# EAGLE design cell-supervisor (EAGLE 5.02)
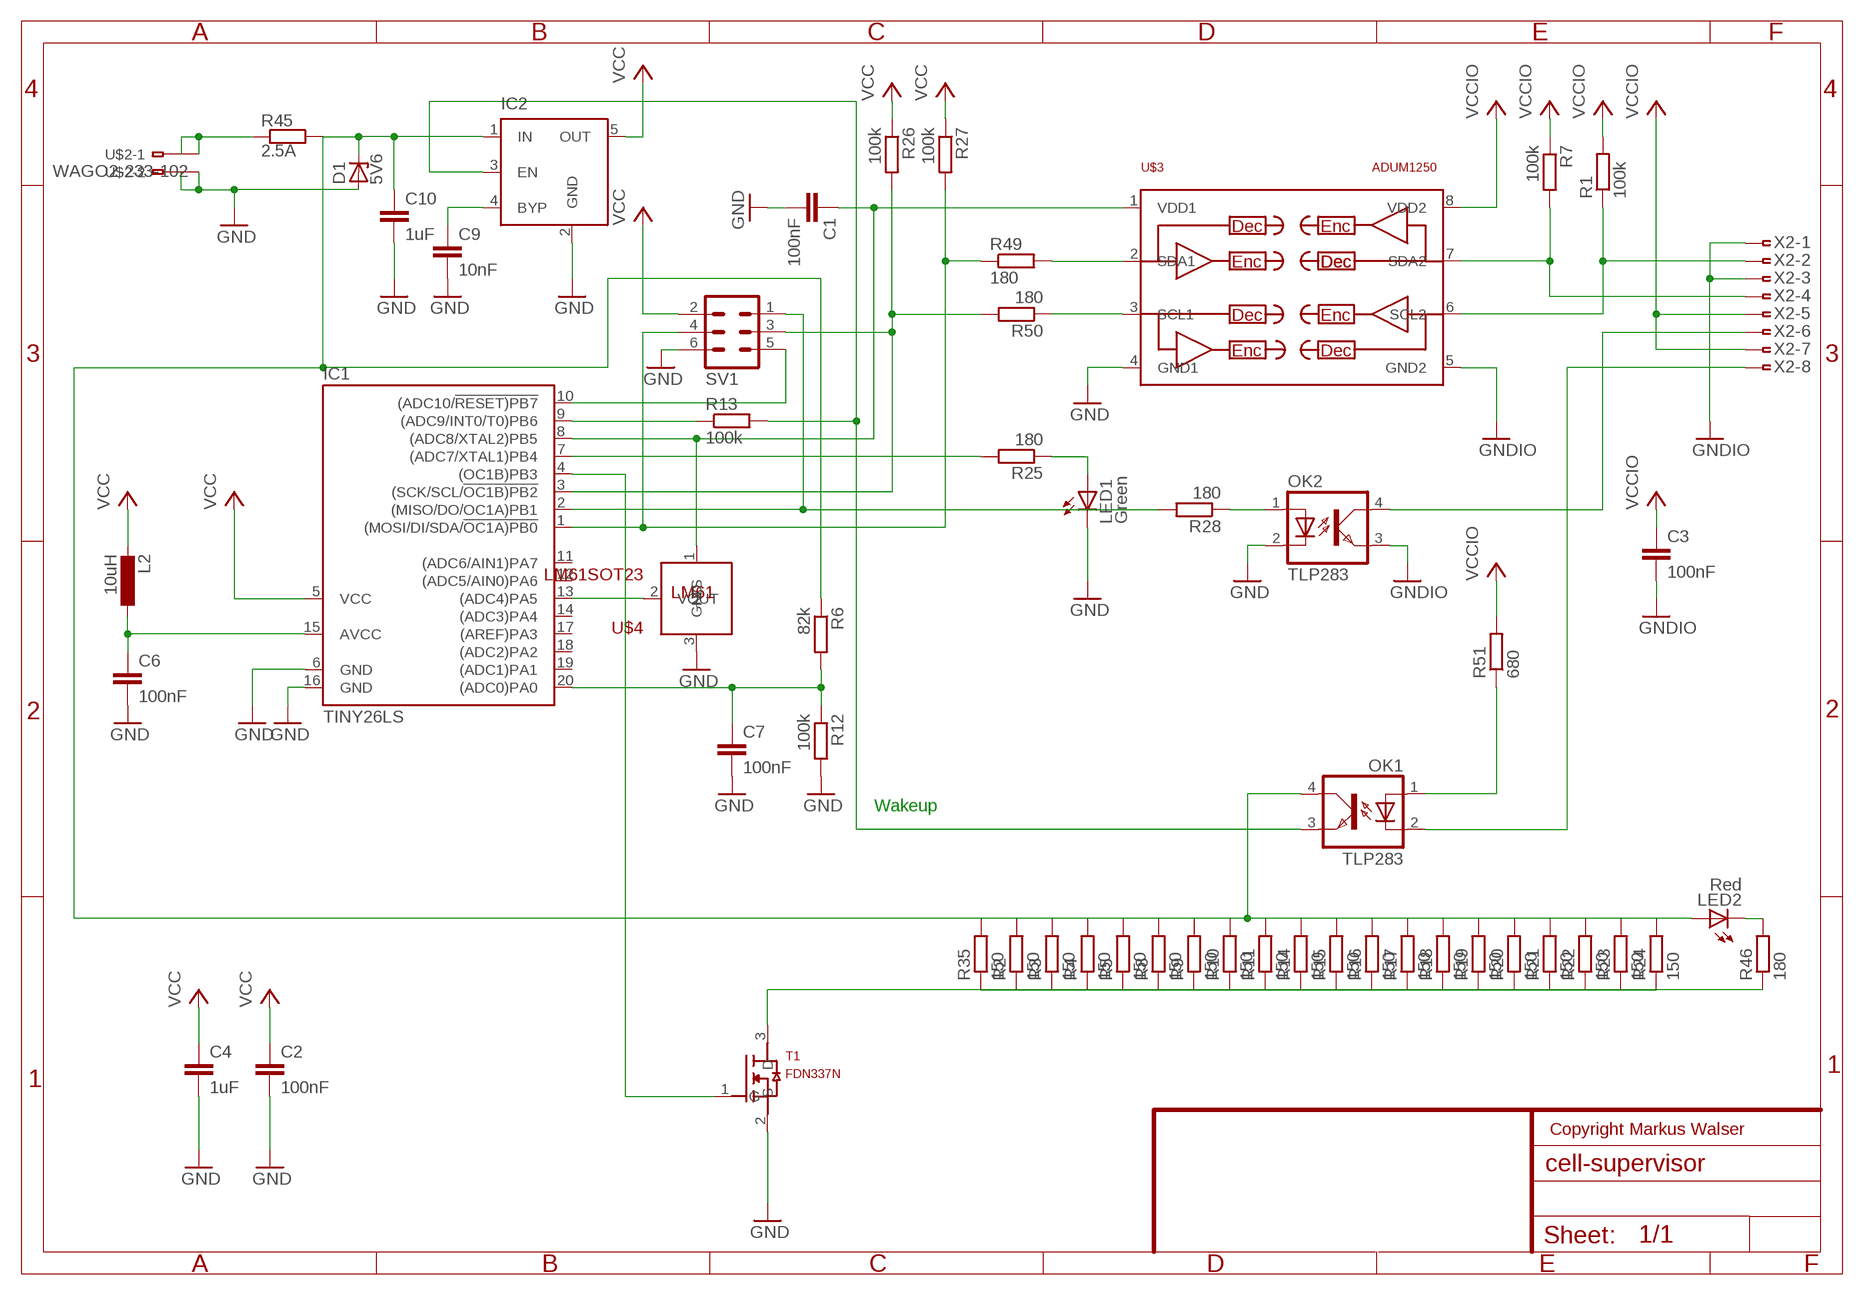
[diagram p0: schematic, sheet 1]

## Parts
C1  100nF  C-EUC0504  [C0504]
C2  100nF  C-EUC0504  [C0504]
C3  100nF  C-EUC0504  [C0504]
C4  1uF  C-EUC0603K  [C0603K]
C6  100nF  C-EUC0504  [C0504]
C7  100nF  C-EUC0504  [C0504]
C9  10nF  C-EUC0504  [C0504]
C10  1uF  C-EUC0603K  [C0603K]
D1  5V6  ZENER-DIODESMB  [SMB]
IC1  TINY26LS  [SO20L]
IC2  MIC5219XX  [SOT23-5]
L2  10uH  L-EUL3225M  [L3225M]
LED1  Green  LEDCHIPLED_0805  [CHIPLED_0805]
LED2  Red  LEDCHIPLED_0805  [CHIPLED_0805]
OK1  TLP283  [MINI-FLAT-4]
OK2  TLP283  [MINI-FLAT-4]
R1  100k  R-EU_M0805  [M0805]
R2  150  R-EU_R1206  [R1206]
R3  150  R-EU_R1206  [R1206]
R4  150  R-EU_R1206  [R1206]
R5  150  R-EU_R1206  [R1206]
R6  82k  R-EU_M0805  [M0805]
R7  100k  R-EU_M0805  [M0805]
R8  150  R-EU_R1206  [R1206]
R9  150  R-EU_R1206  [R1206]
R10  150  R-EU_R1206  [R1206]
R11  150  R-EU_R1206  [R1206]
R12  100k  R-EU_M0805  [M0805]
R13  100k  R-EU_M0805  [M0805]
R14  150  R-EU_R1206  [R1206]
R15  150  R-EU_R1206  [R1206]
R16  150  R-EU_R1206  [R1206]
R17  150  R-EU_R1206  [R1206]
R18  150  R-EU_R1206  [R1206]
R19  150  R-EU_R1206  [R1206]
R20  150  R-EU_R1206  [R1206]
R21  150  R-EU_R1206  [R1206]
R22  150  R-EU_R1206  [R1206]
R23  150  R-EU_R1206  [R1206]
R24  150  R-EU_R1206  [R1206]
R25  180  R-EU_M0805  [M0805]
R26  100k  R-EU_M0805  [M0805]
R27  100k  R-EU_M0805  [M0805]
R28  180  R-EU_M0805  [M0805]
R35  150  R-EU_R1206  [R1206]
R45  2.5A  SMR-WAV  [SMS-WAV]
R46  180  R-EU_M0805  [M0805]
R49  180  R-EU_M0805  [M0805]
R50  180  R-EU_M0805  [M0805]
R51  680  R-EU_M0805  [M0805]
SV1  MA03-2  [MA03-2]
T1  FDN337N  [SOT23]
U$2  WAGO2-233-102  [233-102]
U$3  ADUM1250  [SO8]
U$4  LM61SOT23  [SOT23]
X2  FSIDE-8  [FSIDE-8]

## Nets
GND: C1.2 C2.2 C4.2 C6.2 C7.2 C9.2 C10.2 D1.A IC1.6(GND) IC1.16(GND) IC2.2(GND) LED1.C OK2.2(C) R12.2 SV1.6 T1.2(S) U$2.A2(-2:A1) U$2.B2(-2:B1) U$3.4(GND1) U$4.3(GND)
GNDIO: C3.2 OK2.3(EMIT) U$3.5(GND2) X2.1 X2.3
N$1: C1.1 IC1.8((ADC8/XTAL2)PB5) U$3.1(VDD1) U$4.1(+VS)
N$2: R7.2 U$3.7(SDA2) X2.4
N$3: R1.1 U$3.6(SCL2) X2.2
N$4: IC1.7((ADC7/XTAL1)PB4) R25.2
N$5: LED1.A R25.1
N$6: R49.2 U$3.2(SDA1)
N$7: OK1.2(C) X2.8
N$8: R50.1 U$3.3(SCL1)
N$10: IC1.3((SCK/SCL/!OC1B)PB2) R26.2 R50.2 SV1.3
N$11: LED2.C R46.2
N$13: C10.1 D1.C IC2.1(IN) LED2.A OK1.4(COL) R2.2 R3.2 R4.2 R5.2 R6.1 R8.2 R9.2 R10.2 R11.2 R14.2 R15.2 R16.2 R17.2 R18.2 R19.2 R20.2 R21.2 R22.2 R23.2 R24.2 R35.2 R45.1
N$14: C7.1 IC1.20((ADC0)PA0) R6.2 R12.1
N$15: C6.1 IC1.15(AVCC) L2.1
N$18: OK2.1(A) R28.1
N$19: OK2.4(COL) X2.6
N$20: C9.1 IC2.4(BYP)
N$21: IC1.9((ADC9/INT0/T0)PB6) R13.1
N$22: IC1.13((ADC4)PA5) U$4.2(VOUT)
N$49: R2.1 R3.1 R4.1 R5.1 R8.1 R9.1 R10.1 R11.1 R14.1 R15.1 R16.1 R17.1 R18.1 R19.1 R20.1 R21.1 R22.1 R23.1 R24.1 R35.1 R46.1 T1.3(D)
N$50: IC1.4((OC1B)PB3) T1.1(G)
N$51: IC1.2((MISO/DO/OC1A)PB1) R28.2 SV1.1
N$53: IC1.10((ADC10/!RESET)PB7) SV1.5
N$59: R45.2 U$2.A1(-1:A1) U$2.B1(-1:B1)
N$63: IC1.1((MOSI/DI/SDA/!OC1A)PB0) R27.2 R49.1 SV1.4
N$66: OK1.1(A) R51.1
N$68: IC2.3(EN) OK1.3(EMIT) R13.2
VCC: C2.1 C4.1 IC1.5(VCC) IC2.5(OUT) L2.2 R26.1 R27.1 SV1.2
VCCIO: C3.1 R1.2 R7.1 R51.2 U$3.8(VDD2) X2.5 X2.7
Unconnected: IC1.11((ADC6/AIN1)PA7) IC1.12((ADC5/AIN0)PA6) IC1.14((ADC3)PA4) IC1.17((AREF)PA3) IC1.18((ADC2)PA2) IC1.19((ADC1)PA1)

## Notes on the sheet
- Wakeup
- Copyright Markus Walser

## Library data of the parts
C1-C4 C6 C7 C9 C10 = rcl:C-EU: CAPACITOR, European symbol
D1 = diode:ZENER-DIODE: Z-Diode
IC1 = atmel:TINY26*: 8-bit AVR Microcontroller with 2K Bytes Flash Source: http://www.atmel.com .. doc1477.pdf
IC2 = v-reg-micrel:MIC5219XX: VOLTAGE REGULATOR
L2 = rcl:L-EU: INDUCTOR, European symbol
LED1 LED2 = led:LED: LED OSRAM: - CHIPLED LG R971, LG N971, LY N971, LG Q971, LY Q971, LO R971, LY R971 LH N974, LH R974 LS Q976, LO Q976, LY Q976 LO Q996 - Hyper CHIPLED LW Q18S LB Q993, LB Q99A, LB R99A - SideLED LS A670, LO A670, LY A670, LG A670, LP A670 LB A673, LV A673, LT A673, LW A673 LH A674 LY A675 LS A676, LA A676, LO A676, LY A676, LW A676 LS A679, LY A679, LG A679 - Hyper Micro SIDELED® LS Y876, LA Y876, LO Y876, LY Y876 LT Y87S - SmartLED LW L88C, LW L88S LB L89C, LB L89S, LG L890 LS L89K, LO L89K, LY L89K LS L896, LA L896, LO L896, LY L896 - TOPLED LS T670, LO T670, LY T670, LG T670, LP T670 LSG T670, LSP T670, LSY T670, LOP T670, LYG T670 LG T671, LOG T671, LSG T671 LB T673, LV T673, LT T673, LW T673 LH T674 LS T676, LA T676, LO T676, LY T676, LB T676, LH T676, LSB T676, LW T676 LB T67C, LV T67C, LT T67C, LS T67K, LO T67K, LY T67K, LW E67C LS E67B, LA E67B, LO E67B, LY E67B, LB E67C, LV E67C, LT E67C LW T67C LS T679, LY T679, LG T679 LS T770, LO T770, LY T770, LG T770, LP T770 LB T773, LV T773, LT T773, LW T773 LH T774 LS E675, LA E675, LY E675, LS T675 LS T776, LA T776, LO T776, LY T776, LB T776 LHGB T686 LT T68C, LB T68C - Hyper Mini TOPLED® LB M676 - Mini TOPLED Santana® LG M470 LS M47K, LO M47K, LY M47K Source: http://www.osram.convergy.de - LUMILED® LXK2-PW12-R00, LXK2-PW12-S00, LXK2-PW14-U00, LXK2-PW14-V00 LXK2-PM12-R00, LXK2-PM12-S00, LXK2-PM14-U00 LXK2-PE12-Q00, LXK2-PE12-R00, LXK2-PE12-S00, LXK2-PE14-T00, LXK2-PE14-U00 LXK2-PB12-K00, LXK2-PB12-L00, LXK2-PB12-M00, LXK2-PB14-N00, LXK2-PB14-P00, LXK2-PB14-Q00 LXK2-PR12-L00, LXK2-PR12-M00, LXK2-PR14-Q00, LXK2-PR14-R00 LXK2-PD12-Q00, LXK2-PD12-R00, LXK2-PD12-S00 LXK2-PH12-R00, LXK2-PH12-S00 LXK2-PL12-P00, LXK2-PL12-Q00, LXK2-PL12-R00 Source: www.luxeon.com
OK1 OK2 = optocoupler:TLP283: TOSHIBA PHOTOCOUPLER GaAs IRED & PHOTO-TRANSISTOR Source: http://www.semicon.toshiba.co.jp/td/en/Opto/Photocoupler/en_20050928_TLP283_datasheet.pdf
R1-R28 R35 R46 R49-R51 = rcl:R-EU_: RESISTOR, European symbol
R45 = resistor-shunt:SMR-WAV: SMD SHUNT RESISTOR
SV1 = con-lstb:MA03-2: PIN HEADER
T1 = transistor-fet:FDN337N
U$2 = con-wago:WAGO2-: WAGO Cage Clamp
U$3 = analog-devices:ADUM1250
U$4 = linear:LM61
X2 = con-amp:FSIDE-8: AMP connector

## Board
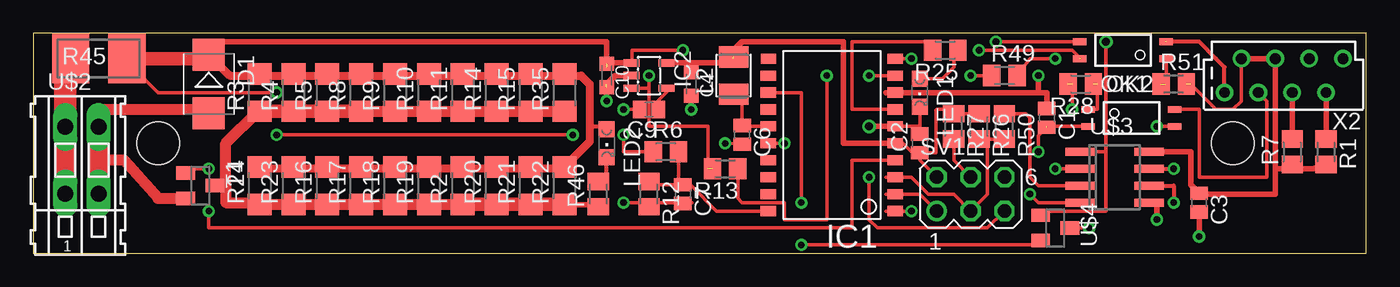
[diagram p1: board, top side]
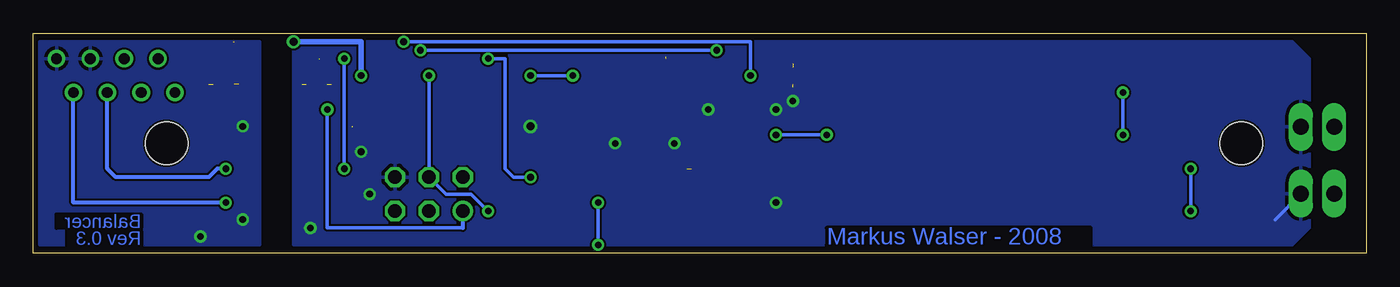
[diagram p2: board, bottom side, seen from below]

Size 100 x 16.5 mm. Coordinates in mm from the lower left corner, seen from the top.
Outline: 0,0 100,0 100,16.5 0,16.5 0,0
Copper layers (1*16): Top 0.035mm / dielectric 1.5mm / Bottom 0.035mm
Design rules "default": minimum track width 10mil, minimum drill 24mil, track to track 6mil, track to pad 6mil, pad to pad 6mil, via to via 6mil, smd to smd 6mil, copper to edge 6mil, drill to drill 6mil, minimum pad ring 10mil, minimum via ring 8mil, stop-mask expansion 4mil, vias tented up to drill 40mil, thermal gap 10mil
Holes 3.2 mm at 9.36,8.25 90,8.25

### Footprints (pad centres in the part's own frame; a part is rotated, then mirrored left to right if it is on the bottom)
C0504 = smd 1 x 1.3: 1 -0.7,0; 2 0.7,0
C0603K = smd 1.05 x 1.08: 1 -0.875,0; 2 0.875,0
SMB = smd 2.4 x 2.4: A 2.2,0; C -2.2,0
SO20L = smd 0.762 x 1.143: 1 -5.08,-5.131; 2 -3.81,-5.131; 3 -2.54,-5.131; 4 -1.27,-5.131; 5 0,-5.131; 6 1.27,-5.131; 7 2.54,-5.131; 8 3.81,-5.131; 9 5.08,-5.131; 10 6.35,-5.131; 11 6.35,4.369; 12 5.08,4.394; 13 3.81,4.394; 14 2.54,4.394; 15 1.27,4.394; 16 0,4.394; 17 -1.27,4.394; 18 -2.54,4.394; 19 -3.81,4.394; 20 -5.08,4.394
SOT23-5 = smd 0.55 x 1.2: 1 -0.95,-1.3; 2 0,-1.3; 3 0.95,-1.3; 4 0.95,1.3; 5 -0.95,1.3
L3225M = smd 1.6 x 2.2: 1 -1.4,0; 2 1.4,0
CHIPLED_0805 = smd 1.2 x 1.2: A 0,-1.05; C 0,1.05
MINI-FLAT-4 = smd 1 x 0.5: 1 -3.24,0.635; 2 -3.24,-0.635; 3 3.24,-0.635; 4 3.24,0.635
M0805 = smd 1.3 x 1.6: 1 -0.95,0; 2 0.95,0
R1206 = smd 1.6 x 1.8: 1 -1.4,0; 2 1.4,0
SMS-WAV = smd 2.8 x 3.7: 1 2.108,0; 2 -2.108,0
MA03-2 = drill 1.016 round: 1 -2.54,-1.27 | drill 1.016 octagon: 2 -2.54,1.27; 3 0,-1.27; 4 0,1.27; 5 2.54,-1.27; 6 2.54,1.27
SOT23 = smd 1 x 1.4: 1 -0.95,-1.1; 2 0.95,-1.1; 3 0,1.1
233-102 = drill 1.2 long: A1 -1.25,2.5; A2 1.25,2.5; B1 -1.25,-2.5; B2 1.25,-2.5
SO8 = smd 0.6 x 2.2: 1 -1.905,-2.6; 2 -0.635,-2.6; 3 0.635,-2.6; 4 1.905,-2.6; 5 1.905,2.6; 6 0.635,2.6; 7 -0.635,2.6; 8 -1.905,2.6
FSIDE-8 = drill 0.813 round: 1 -4.445,-1.27; 2 -3.175,1.27; 3 -1.905,-1.27; 4 -0.635,1.27; 5 0.635,-1.27; 6 1.905,1.27; 7 3.175,-1.27; 8 4.445,1.27

### Placement (x,y rotation side)
C1  76.03,10.16 270 top
C2  66.51,8.25 90 top
C3  87.47,3.81 270 top
C4  49.37,12.7 270 top
C6  53.17,8.89 270 top
C7  48.73,4.44 270 top
C9  46.19,10.79 180 top
C10  43.02,13.33 270 top
D1  13.17,12.7 270 top
IC1  59.52,8.25 90 top
IC2  46.19,13.33 270 top
L2  52.54,13.33 90 top
LED1  66.51,12.06 180 top
LED2  43.02,8.25 180 top
OK1  81.75,15.23 180 top
OK2  82.39,10.16 0 top
R1  96.99,7.62 270 top
R2  32.22,5.08 90 top
R3  16.98,12.06 90 top
R4  19.52,12.06 90 top
R5  22.06,12.06 90 top
R6  47.46,7.62 0 top
R7  94.45,7.62 90 top
R8  24.6,12.06 90 top
R9  27.14,12.06 90 top
R10  29.68,12.06 90 top
R11  32.22,12.06 90 top
R12  46.19,4.44 270 top
R13  51.91,6.34 180 top
R14  34.76,12.06 90 top
R15  37.3,12.06 90 top
R16  22.06,5.08 90 top
R17  24.6,5.08 90 top
R18  27.14,5.08 90 top
R19  29.68,5.08 90 top
R20  34.76,5.08 90 top
R21  37.3,5.08 90 top
R22  39.84,5.08 90 top
R23  19.52,5.08 90 top
R24  16.98,5.08 90 top
R25  68.41,15.23 180 top
R26  70.95,9.52 270 top
R27  69.05,9.52 270 top
R28  78.58,12.7 180 top
R35  39.84,12.06 90 top
R45  4.92,14.6 0 top
R46  42.38,4.44 90 top
R49  72.86,13.33 0 top
R50  72.86,9.52 270 top
R51  85.56,12.7 0 top
SV1  70.32,4.44 0 top
T1  12.54,5.08 270 top
U$2  3.64,6.98 0 top
U$3  81.11,5.71 270 top
U$4  76.67,1.9 270 top
X2  93.81,13.33 180 top

### Tracks (layer width: path | path; a pad name or v marks a point on that pad's centre or on a via)
GND  (via drill 0.5, 0.6)  (2 unrouted)
  Top 0.254: R12.2 46.82,3.81 47.46,3.81 | C7.2 48.8,3.81 48.73,3.81 | 47.46,3.81 47.14,3.81 | 48.73,3.81 47.46,3.81 | 49.37,3.81 48.73,3.81 | C7.2 49.43,3.81 | 53.11,8.25 C6.2 v51.91,8.25 | 66.51,8.89 C2.2 66.51,9.52 | 66.51,9.52 LED1.C | IC1.6 66.51,9.52 | 49.37,3.81 C7.2 | v44.28,3.81 49.37,3.81 | IC1.16 v56.35,8.25 | 76.03,9.52 OK2.2 | U$4.3 v79.21,1.9 | C1.2 75.4,8.82 v75.4,7.62 | U$3.4 75.4,3.81 v74.77,4.44 | C9.2 v44.28,10.79
  Top 0.406: v62.7,9.52 IC1.6 | IC2.2 43.65,13.33 43.02,12.7 v43.02,11.42 | C4.2 v49.37,10.79
  Top 0.813: D1.A 13.17,10.79 4.92,10.79 4.92,10.16 | 4.92,10.16 4.92,10.14 U$2.A2 4.89,10.14 4.92,10.16 | T1.2 9.36,4.12 6.82,6.98 6.79,7.01 4.92,7.01 4.92,4.44 4.89,4.46 U$2.B2
  Top 1.676: U$2.B2 4.89,10.14
  Bottom 0.254: 4.92,3.81 4.94,5.05 4.89,5.09 U$2.B2 4.89,4.46 6.82,2.53
  pour Bottom: 4.28,1.9 4.28,14.6 5.55,15.87 80.48,15.87 80.48,0.63 5.55,0.63
GNDIO  (via drill 0.5)
  Top 0.254: U$3.5 84.29,3.81 | OK2.3 v84.29,9.52
  Top 0.406: U$3.5 83.66,3.81 | 84.29,3.81 v84.29,2.53 | C3.2 v87.47,1.27
  pour Bottom: 83.02,0.63 83.02,15.87 99.53,15.87 99.53,0.63
N$1  (via drill 0.5, 0.6)
  Top 0.254: U$4.1 75.89,2.53 75.4,2.53 75.4,3.17 80.48,3.17 80.48,7.62 | 80.48,7.62 v80.48,15.87 | 80.48,7.62 77.94,7.62
  Top 0.406: 63.97,12.06 IC1.8 75.4,12.06 | v75.4,13.33 75.4,12.06 | 75.4,12.06 76.03,12.06 C1.1 | 77.94,7.62 U$3.1
  Bottom 0.406: v80.48,15.87 75.4,15.87 v75.4,13.33
N$2  (via drill 0.5)
  Top 0.305: U$3.7 v85.56,6.34
  Top 0.406: X2.4 R7.2
  Bottom 0.305: v85.56,6.34 86.19,6.34 86.83,5.71 93.81,5.71 94.45,6.34 X2.4
N$3  (via drill 0.5)
  Top 0.305: U$3.6 85.56,5.08 v85.56,3.81
  Top 0.406: X2.2 R1.1
  Bottom 0.305: v85.56,3.81 96.99,3.81 X2.2
N$4
  Top 0.254: R25.2 67.47,15.87 61.43,15.87 61.43,10.79 IC1.7
N$5
  Top 0.254: LED1.A 68.19,13.11 69.05,13.97 69.05,15.23 R25.1
N$6  (via drill 0.5)
  Top 0.254: v76.67,14.6 74.77,14.6 R49.2 | U$3.2 v76.67,6.34
  Bottom 0.254: v76.67,6.34 v76.67,14.6
N$7  (1 unrouted)
  Top 0.305: X2.8 89.37,13.97 88.73,14.6 87.47,15.87 84.92,15.87
N$8
  Top 0.254: 77.94,5.08 U$3.3 75.4,5.08 74.77,5.71 74.77,10.16 74.45,10.47 R50.1
N$10
  Top 0.254: 63.97,5.71 IC1.3 65.88,5.71 67.14,4.44 69.05,4.44 SV1.3 71.59,4.44 71.59,8.25 70.95,8.89 | R50.2 71.27,8.57 70.95,8.89 | 70.95,8.89 R26.2
N$11
  Top 0.305: R46.2 42.38,5.08 43.02,5.71 LED2.C
N$13  (via drill 0.5)  (2 unrouted)
  Top 0.254: 6.82,14.6 9.36,12.06 v18.25,12.06 | v18.25,8.89 v40.48,8.89 | v70.95,15.23 77.94,15.23 78.58,14.6 | v44.28,8.89 44.28,7.62 R6.1 | IC2.1 44.92,14.28 44.92,15.23 v48.73,15.23
  Top 0.305: LED2.A 42.8,9.52 41.74,9.52
  Top 0.406: D1.C 13.17,15.87 43.02,15.87 C10.1 | 37.3,13.33 R15.2 37.17,13.33 | 39.71,13.33 R35.2 | 34.76,13.33 R14.2 34.63,13.33 | 32.22,13.33 R11.2 32.09,13.33 | 29.68,13.33 R10.2 29.55,13.33 | 27.14,13.33 R9.2 27.01,13.33 | 24.6,13.33 R8.2 24.47,13.33 | 22.06,13.33 R5.2 21.93,13.33 | 19.52,13.33 R4.2 19.39,13.33 | 16.98,13.33 R3.2 | IC2.1 43.33,14.28 43.02,13.97
  Top 0.61: 37.3,13.33 39.71,13.33 | 34.76,13.33 37.17,13.33 | 32.22,13.33 34.63,13.33 | 29.68,13.33 32.09,13.33 | 27.14,13.33 29.55,13.33 | 24.6,13.33 27.01,13.33 | 22.06,13.33 24.47,13.33 | 19.52,13.33 21.93,13.33 | 19.39,13.33 16.98,13.33 14.74,13.33 D1.C | R35.2 39.84,13.33 41.11,13.33 41.74,12.7 41.74,9.52 41.74,8.38 R22.2 39.71,6.34 37.3,6.34 R21.2 37.17,6.34 34.76,6.34 R20.2 34.63,6.34 32.22,6.34 R2.2 32.09,6.34 29.68,6.34 R19.2 29.55,6.34 27.14,6.34 R18.2 27.01,6.34 24.6,6.34 R17.2 24.47,6.34 22.06,6.34 R16.2 21.93,6.34 19.52,6.34 R23.2 19.39,6.34 16.98,6.34 R24.2
  Top 1.016: D1.C 13.17,14.6 6.82,14.6 R45.1
  Bottom 0.254: v18.25,12.06 v18.25,8.89 | v40.48,8.89 v44.28,8.89 | v48.73,15.23 v70.95,15.23
N$14
  Top 0.254: IC1.20 51.27,3.17 49.37,5.08 48.73,5.08 | R12.1 46.82,5.08 46.89,5.14 C7.1 48.73,5.08 | R6.2 48.41,5.4 48.73,5.08
N$15
  Top 0.254: 53.17,9.52 IC1.15 | C6.1 53.17,9.52 | L2.1 53.05,12.06 53.17,12.06 53.17,9.52
N$18  (1 unrouted)
  Top 0.254: OK2.1 79.84,10.79 79.84,12.7
N$19
  Top 0.254: X2.6 92.55,11.42 92.55,5.71 87.47,5.71 87.47,10.79 OK2.4
N$20
  Top 0.254: C9.1 46.89,11.49 47.49,12.09 IC2.4
N$21  (via drill 0.5)
  Top 0.254: v62.7,13.33 IC1.9 | R13.1 52.85,4.12 53.17,3.81 56.35,3.81 56.35,2.53 59.52,2.53 v59.52,13.33
  Bottom 0.254: v59.52,13.33 v62.7,13.33
N$22  (via drill 0.5)
  Top 0.254: v57.62,3.81 57.62,12.06 IC1.13 | U$4.2 75.89,0.63 v57.62,0.63
  Bottom 0.254: v57.62,0.63 v57.62,3.81
N$49
  Top 0.406: R46.1 42.38,3.81 41.57,3.64 40.01,3.64
  Top 0.61: T1.3 14.44,5.08
  Top 0.813: 24.6,10.79 24.73,10.66 R9.1 27.14,10.79 27.27,10.66 R10.1 29.68,10.79 29.81,10.66 R11.1 32.22,10.79 32.35,10.66 R14.1 34.76,10.79 34.89,10.66 R15.1 37.3,10.79 37.43,10.66 R35.1 | R2.1 29.81,3.67 29.68,3.81 R19.1 27.27,3.67 27.14,3.81 R18.1 24.73,3.67 24.6,3.81 R17.1 22.19,3.67 22.06,3.81 R16.1 19.65,3.67 19.52,3.81 R23.1 17.11,3.67 16.98,3.81 | 39.84,3.81 40.01,3.64 | 16.98,3.81 R24.1 | 16.98,3.81 14.44,3.81 14.44,5.08 14.44,8.25 16.85,10.66 R3.1
  Top 1.016: R3.1 19.39,10.66 19.52,10.79 R4.1 21.93,10.66 22.06,10.79 R5.1 24.47,10.66 24.6,10.79 R8.1 | R22.1 39.84,3.81 39.71,3.67 R21.1 34.89,3.67 34.76,3.81 R20.1 32.35,3.67 32.22,3.81 R2.1
N$50  (via drill 0.5)
  Top 0.254: IC1.4 61.43,6.98 61.43,1.9 13.17,1.9 v13.17,3.17 | 11.27,6.03 11.27,5.71 | 11.27,6.03 T1.1 | v13.17,6.34 11.27,6.34 11.27,6.03
  Bottom 0.254: v13.17,3.17 v13.17,6.34
N$51  (via drill 0.5)  (1 unrouted)
  Top 0.254: SV1.1 66.51,4.44 IC1.2 63.97,4.44 | v77.94,10.79 77.94,12.7
  Bottom 0.254: 67.78,1.9 77.94,1.9 v77.94,10.79
  Bottom 0.305: SV1.1 67.78,1.9
N$53  (via drill 0.5, 0.5 pad 0.25)
  Top 0.254: SV1.5 71.59,1.9 63.34,1.9 62.7,2.53 v62.7,5.71 | v65.88,14.6 IC1.10
  Bottom 0.254: v62.7,5.71 63.97,5.71 64.61,6.34 64.61,14.6 v65.88,14.6
N$59
  Top 0.813: R45.2 2.58,14.4 2.38,14.6 3.01,14.6 2.38,13.97 2.38,12.7 2.4,12.67 | U$2.A1 2.4,10.14 2.38,10.16
  Top 1.676: U$2.A1 2.4,12.67 | U$2.B1 2.4,10.14
N$63  (via drill 0.5, 0.5 pad 0.3)
  Top 0.254: v70.32,13.33 R49.1 | 63.97,3.17 IC1.1 v65.88,3.17 | R27.2 69.05,6.98 SV1.4
  Bottom 0.254: v70.32,13.33 SV1.4 69.05,4.44 67.14,4.44 v65.88,3.17
N$66  (1 unrouted)
  Top 0.254: 84.99,12.76 OK1.1
  Top 0.305: 84.92,12.7 84.99,12.76
N$68  (via drill 0.5)  (1 unrouted)
  Top 0.254: v72.22,15.87 OK1.3 78.58,15.87 | 46.19,12.7 46.19,9.52 50.63,9.52 50.63,6.34 51.27,6.34 | 46.19,12.7 v46.19,13.33 | IC2.3 46.19,12.38 46.19,12.7
  Bottom 0.254: v72.22,15.87 50.63,15.87 46.19,15.87 v46.19,13.33
VCC  (1 unrouted)
  Top 0.254: IC1.5 65.24,8.25 65.88,7.62 66.51,7.62 | SV1.2 66.51,6.98 66.51,7.62 | 66.51,7.62 C2.1 67.72,7.55 67.72,10.73 67.78,10.79 69.05,10.79 R27.1 69.05,10.16 69.36,10.47 R26.1
  Top 0.406: L2.2 52.54,15.23 53.17,15.87 60.8,15.87 60.8,8.25 IC1.5 | IC2.5 49.37,14.28 | 49.37,14.28 52.22,14.28 52.54,14.6 | 49.37,14.28 C4.1
VCCIO  (1 unrouted)
  Top 0.254: X2.7 90.64,11.42 90,10.79 88.73,10.79 86.83,12.7 86.19,12.7 | C3.1 87.53,4.44
  Top 0.406: U$3.8 83.66,7.62 | 83.66,7.62 83.02,7.62 | 93.81,6.34 R7.1 94.77,6.34 | R1.2 96.03,6.34 94.77,6.34 | 93.18,6.34 93.81,6.34 | 93.81,6.34 94.77,6.34 | 93.18,6.34 93.18,4.44 87.53,4.44 | X2.7 X2.5 93.18,6.34 | C3.1 86.83,5.14 86.83,7.62 83.66,7.62

### Text on the board
Bottom: Balancer | Markus Walser - 2008 | Rev 0.3